# Altium schematic sheet Header.SchDoc
size A4; SheetNumber: 12; SheetTotal: 12
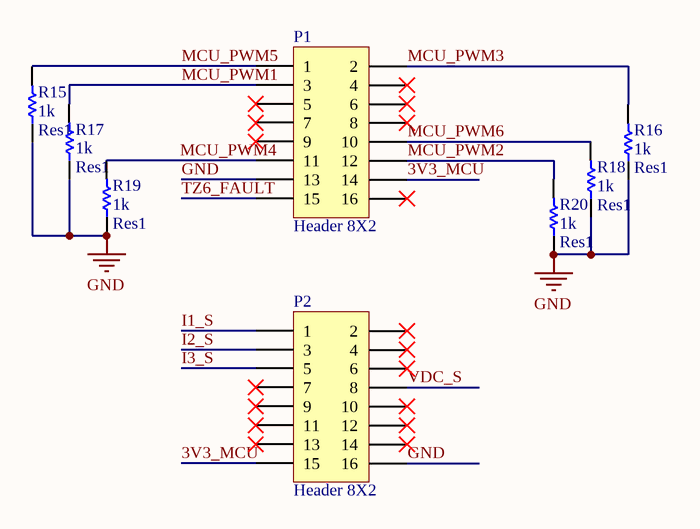
[diagram p0: Header.SchDoc]

## Parts
P1  Header 8X2  [HDR2X8]
P2  Header 8X2  [HDR2X8]
R15  Res1  value 1k  [AXIAL-0.4]
R16  Res1  value 1k  [AXIAL-0.4]
R17  Res1  value 1k  [AXIAL-0.4]
R18  Res1  value 1k  [AXIAL-0.4]
R19  Res1  value 1k  [AXIAL-0.4]
R20  Res1  value 1k  [AXIAL-0.4]

## Nets
GND: P1.13 P2.16 R15.1 R16.1 R17.1 R18.1 R19.1 R20.1
3V3_MCU: P1.14 P2.15
I1_S: P2.1
I2_S: P2.3
I3_S: P2.5
MCU_PWM1: P1.3 R17.2
MCU_PWM2: P1.12 R20.2
MCU_PWM3: P1.2 R16.2
MCU_PWM4: P1.11 R19.2
MCU_PWM5: P1.1 R15.2
MCU_PWM6: P1.10 R18.2
TZ6_FAULT: P1.15
VDC_S: P2.8

Not connected (* = marked no-connect by the designer): P1 4* 5* 6* 7* 8* 9* 16*; P2 2* 4* 6* 7* 9* 10* 11* 12* 13* 14*

## Library data of the parts
P1 P2 = Header 8X2: Header, 8-Pin, Dual row; LatestRevisionDate: 17-Jul-2002; LatestRevisionNote: Re-released for DXP Platform.; Publisher: Altium Limited
R15-R20 = Res1: Resistor; Published: 8-Jun-2000; LatestRevisionDate: 17-Jul-2002; LatestRevisionNote: Re-released for DXP Platform.; PackageReference: AXIAL-0.3; Publisher: Altium Limited; PackageDescription: Axial Device, Thru-Hole; 2 Leads; 0.3 in Pin Spacing